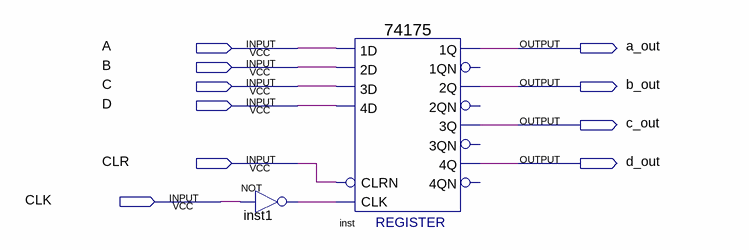
[diagram p0: schematic sheet]
// Quartus schematic Lab_8_Section_2.bdf as structural Verilog: 2 symbols, 10 pins
module Lab_8_Section_2 (
  input  A,
  input  B,
  input  C,
  input  D,
  input  CLR,
  input  CLK,
  output a_out,
  output b_out,
  output c_out,
  output d_out
);

  wire inst1_out;

  not inst1 (inst1_out, CLK);
  \74175  inst (
    .CLRN(CLR), .CLK(inst1_out), .\3D (C), .\2D (B), .\1D (A), .\4D (D), .\1Q (a_out), .\3Q (c_out),
    .\2Q (b_out), .\4Q (d_out));  // open: 1QN, 2QN, 4QN, 3QN
endmodule
